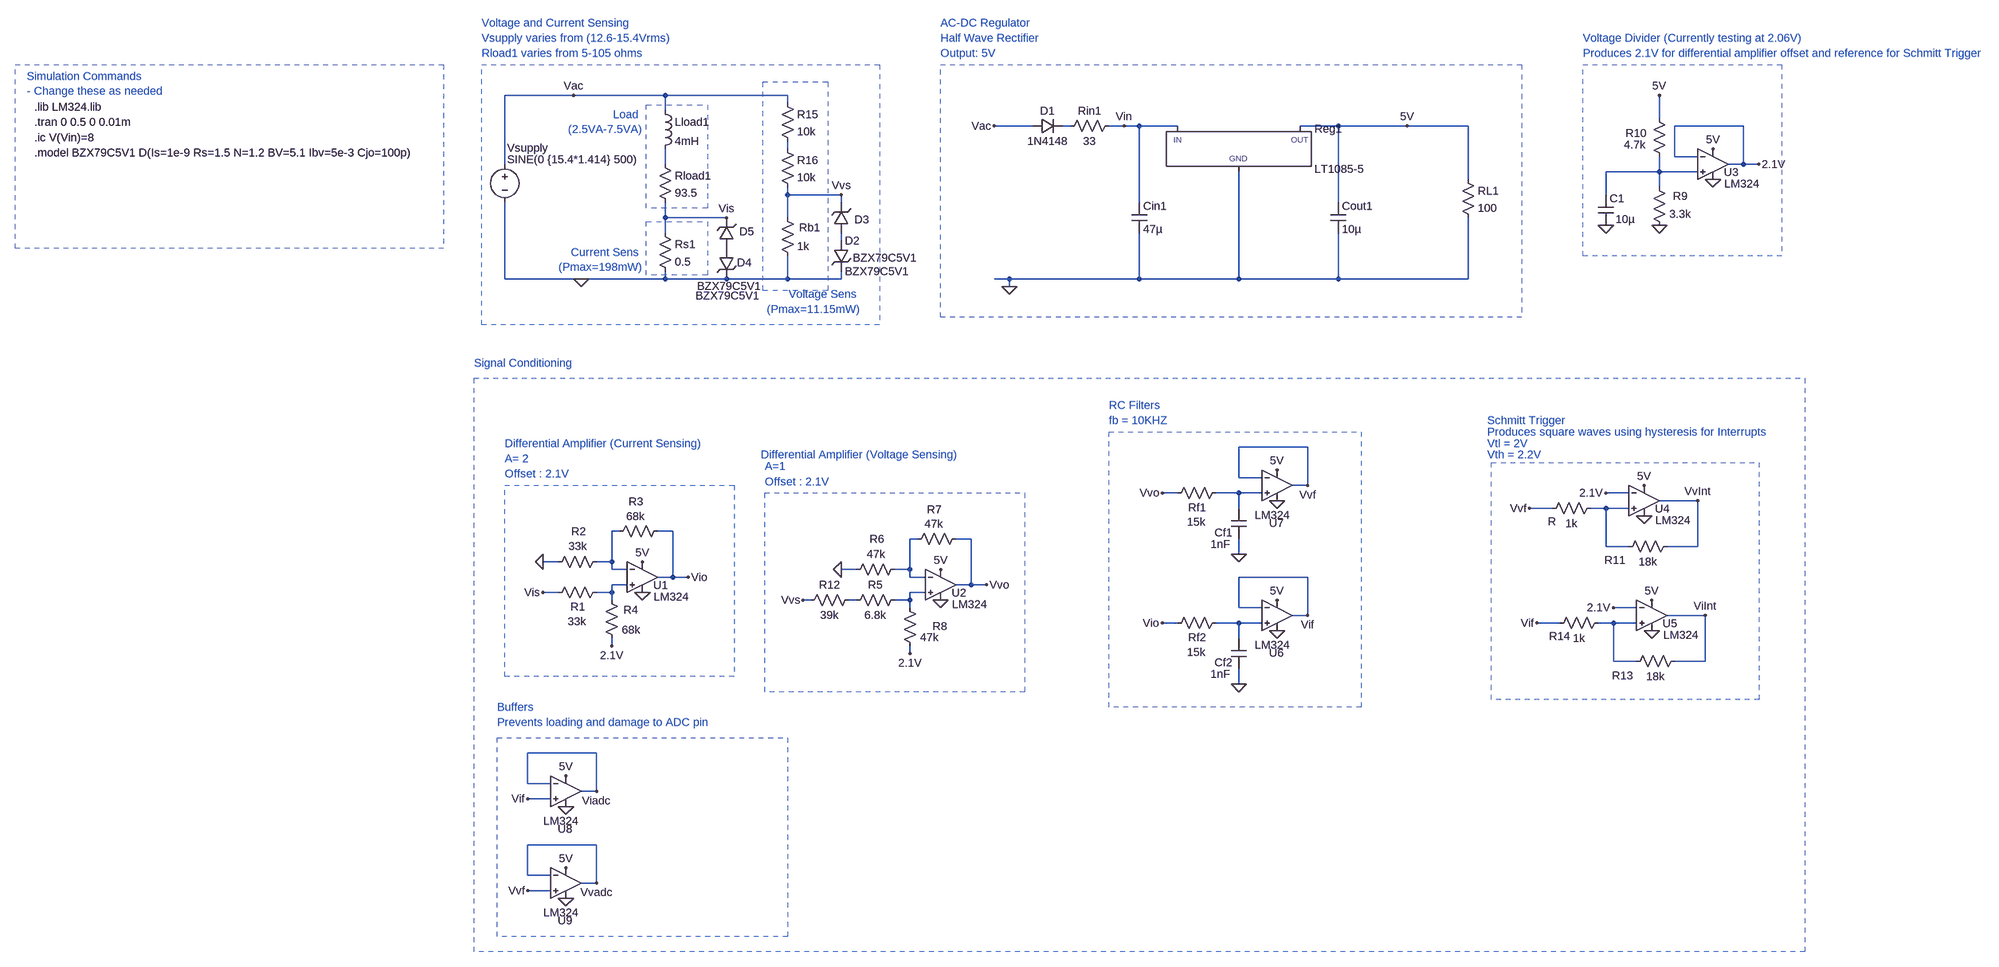
[diagram p0: schematic LTspice Model.asc]
LTspice Model.asc, the LTspice schematic file:
Version 4.1
SHEET 1 2932 1380
WIRE -528 -960 -672 -960
WIRE -336 -960 -528 -960
WIRE -80 -960 -336 -960
WIRE -80 -944 -80 -960
WIRE -336 -928 -336 -960
WIRE 1744 -912 1744 -960
WIRE 432 -896 352 -896
WIRE 512 -896 496 -896
WIRE 624 -896 592 -896
WIRE 656 -896 624 -896
WIRE 736 -896 656 -896
WIRE 1072 -896 992 -896
WIRE 1216 -896 1072 -896
WIRE 1344 -896 1216 -896
WIRE 1920 -896 1776 -896
WIRE -80 -848 -80 -864
WIRE 1776 -832 1776 -896
WIRE 1824 -832 1776 -832
WIRE -672 -816 -672 -960
WIRE -336 -816 -336 -848
WIRE 1920 -816 1920 -896
WIRE 1920 -816 1888 -816
WIRE 1952 -816 1920 -816
WIRE 1744 -800 1744 -832
WIRE 1744 -800 1632 -800
WIRE 1824 -800 1744 -800
WIRE 1344 -784 1344 -896
WIRE 1744 -768 1744 -800
WIRE -80 -752 -80 -768
WIRE 32 -752 -80 -752
WIRE 1632 -752 1632 -800
WIRE 32 -736 32 -752
WIRE 656 -736 656 -896
WIRE 1072 -736 1072 -896
WIRE -336 -704 -336 -736
WIRE -208 -704 -336 -704
WIRE -80 -704 -80 -752
WIRE -336 -672 -336 -704
WIRE 32 -656 32 -672
WIRE -672 -576 -672 -736
WIRE -512 -576 -672 -576
WIRE -336 -576 -336 -592
WIRE -336 -576 -512 -576
WIRE -208 -576 -336 -576
WIRE -80 -576 -80 -624
WIRE -80 -576 -208 -576
WIRE 32 -576 32 -592
WIRE 32 -576 -80 -576
WIRE 384 -576 352 -576
WIRE 656 -576 656 -672
WIRE 656 -576 384 -576
WIRE 864 -576 864 -800
WIRE 864 -576 656 -576
WIRE 1072 -576 1072 -672
WIRE 1072 -576 864 -576
WIRE 1344 -576 1344 -704
WIRE 1344 -576 1072 -576
WIRE 384 -560 384 -576
WIRE 1008 -224 864 -224
WIRE 864 -160 864 -224
WIRE 912 -160 864 -160
WIRE 1008 -144 1008 -224
WIRE 1008 -144 976 -144
WIRE 736 -128 704 -128
WIRE 864 -128 816 -128
WIRE 912 -128 864 -128
WIRE 1680 -128 1632 -128
WIRE 1824 -112 1744 -112
WIRE 864 -96 864 -128
WIRE 1520 -96 1472 -96
WIRE 1632 -96 1600 -96
WIRE 1680 -96 1632 -96
WIRE -432 -48 -448 -48
WIRE -320 -48 -352 -48
WIRE 192 -32 176 -32
WIRE 304 -32 272 -32
WIRE 1632 -16 1632 -96
WIRE 1680 -16 1632 -16
WIRE 1824 -16 1824 -112
WIRE 1824 -16 1760 -16
WIRE 864 0 864 -32
WIRE -560 16 -592 16
WIRE -448 16 -448 -48
WIRE -448 16 -480 16
WIRE -448 32 -448 16
WIRE -416 32 -448 32
WIRE 64 32 32 32
WIRE 176 32 176 -32
WIRE 176 32 144 32
WIRE -320 48 -320 -48
WIRE -320 48 -352 48
WIRE -288 48 -320 48
WIRE 176 48 176 32
WIRE 208 48 176 48
WIRE 1008 48 864 48
WIRE -416 64 -448 64
WIRE 304 64 304 -32
WIRE 304 64 272 64
WIRE 336 64 304 64
WIRE -560 80 -592 80
WIRE -448 80 -448 64
WIRE -448 80 -480 80
WIRE 208 80 176 80
WIRE -448 96 -448 80
WIRE -32 96 -48 96
WIRE 64 96 48 96
WIRE 176 96 176 80
WIRE 176 96 144 96
WIRE 176 112 176 96
WIRE 864 112 864 48
WIRE 912 112 864 112
WIRE 1696 112 1648 112
WIRE 1008 128 1008 48
WIRE 1008 128 976 128
WIRE 1840 128 1760 128
WIRE 736 144 704 144
WIRE 864 144 816 144
WIRE 912 144 864 144
WIRE 1536 144 1488 144
WIRE 1648 144 1616 144
WIRE 1696 144 1648 144
WIRE 864 176 864 144
WIRE -448 192 -448 176
WIRE 176 208 176 192
WIRE 1648 224 1648 144
WIRE 1696 224 1648 224
WIRE 1840 224 1840 128
WIRE 1840 224 1776 224
WIRE 864 272 864 240
WIRE -480 416 -624 416
WIRE -624 480 -624 416
WIRE -576 480 -624 480
WIRE -480 496 -480 416
WIRE -480 496 -512 496
WIRE -576 512 -624 512
WIRE -480 608 -624 608
WIRE -624 672 -624 608
WIRE -576 672 -624 672
WIRE -480 688 -480 608
WIRE -480 688 -512 688
WIRE -576 704 -624 704
FLAG -512 -576 0
FLAG -528 -960 Vac
FLAG -208 -704 Vis
FLAG 32 -752 Vvs
FLAG -384 80 0
FLAG -384 16 5V
FLAG -592 80 Vis
FLAG -592 16 0
FLAG -288 48 Vio
FLAG -448 192 2.1V
FLAG 240 96 0
FLAG 240 32 5V
FLAG 32 32 0
FLAG 336 64 Vvo
FLAG 176 208 2.1V
FLAG 384 -560 0
FLAG 352 -896 Vac
FLAG 1216 -896 5V
FLAG 624 -896 Vin
FLAG 864 0 0
FLAG 704 -128 Vvo
FLAG 864 272 0
FLAG 704 144 Vio
FLAG 1856 -784 0
FLAG 1856 -848 5V
FLAG 1952 -816 2.1V
FLAG 1744 -688 0
FLAG 1712 -80 0
FLAG 1712 -144 5V
FLAG 1728 160 0
FLAG 1728 96 5V
FLAG 1840 128 ViInt
FLAG 1824 -112 VvInt
FLAG 1744 -960 5V
FLAG 1632 -688 0
FLAG 1472 -96 Vvf
FLAG 1488 144 Vif
FLAG 1648 112 2.1V
FLAG 944 160 0
FLAG 944 96 5V
FLAG 1008 128 Vif
FLAG 944 -112 0
FLAG 944 -176 5V
FLAG 1008 -144 Vvf
FLAG 1632 -128 2.1V
FLAG -544 528 0
FLAG -544 464 5V
FLAG -480 496 Viadc
FLAG -624 512 Vif
FLAG -544 720 0
FLAG -544 656 5V
FLAG -480 688 Vvadc
FLAG -624 704 Vvf
FLAG -48 96 Vvs
SYMBOL voltage -672 -832 R0
WINDOW 0 5 -18 Left 2
WINDOW 3 5 6 Left 2
WINDOW 123 0 0 Left 0
WINDOW 39 0 0 Left 0
SYMATTR InstName Vsupply
SYMATTR Value SINE(0 {15.4*1.414} 500)
SYMBOL res -352 -832 R0
SYMATTR InstName Rload1
SYMATTR Value 93.5
SYMBOL ind -352 -944 R0
SYMATTR InstName Lload1
SYMATTR Value 4mH
SYMBOL res -352 -688 R0
SYMATTR InstName Rs1
SYMATTR Value 0.5
SYMBOL res -96 -720 R0
WINDOW 0 40 37 Left 2
SYMATTR InstName Rb1
SYMATTR Value 1k
SYMBOL Opamps/opamp2 -384 -16 R0
WINDOW 0 23 81 Left 2
WINDOW 3 24 105 Left 2
SYMATTR InstName U1
SYMATTR Value LM324
SYMBOL res -464 64 R90
WINDOW 0 62 55 VBottom 2
WINDOW 3 61 57 VTop 2
SYMATTR InstName R1
SYMATTR Value 33k
SYMBOL res -464 0 R90
WINDOW 0 -32 53 VBottom 2
WINDOW 3 -32 55 VTop 2
SYMATTR InstName R2
SYMATTR Value 33k
SYMBOL res -336 -64 R90
WINDOW 0 -30 61 VBottom 2
WINDOW 3 -31 62 VTop 2
SYMATTR InstName R3
SYMATTR Value 68k
SYMBOL res -432 192 R180
WINDOW 0 -39 75 Left 2
WINDOW 3 -44 34 Left 2
SYMATTR InstName R4
SYMATTR Value 68k
SYMBOL Opamps/opamp2 240 0 R0
WINDOW 0 23 81 Left 2
WINDOW 3 24 105 Left 2
SYMATTR InstName U2
SYMATTR Value LM324
SYMBOL res 160 16 R90
WINDOW 0 -32 53 VBottom 2
WINDOW 3 -32 55 VTop 2
SYMATTR InstName R6
SYMATTR Value 47k
SYMBOL res 288 -48 R90
WINDOW 0 -30 61 VBottom 2
WINDOW 3 -31 62 VTop 2
SYMATTR InstName R7
SYMATTR Value 47k
SYMBOL res 192 208 R180
WINDOW 0 -62 57 Left 2
WINDOW 3 -44 34 Left 2
SYMATTR InstName R8
SYMATTR Value 47k
SYMBOL PowerProducts/LT1085-5 864 -896 R0
SYMATTR InstName Reg1
SYMBOL res 1328 -800 R0
SYMATTR InstName RL1
SYMATTR Value 100
SYMBOL res 608 -912 R90
WINDOW 0 0 56 VBottom 2
WINDOW 3 32 56 VTop 2
SYMATTR InstName Rin1
SYMATTR Value 33
SYMBOL diode 432 -880 R270
WINDOW 0 32 32 VTop 2
WINDOW 3 0 32 VBottom 2
SYMATTR InstName D1
SYMATTR Value 1N4148
SYMBOL cap 640 -736 R0
SYMATTR InstName Cin1
SYMATTR Value 47µ
SYMATTR SpiceLine Rser=0.001
SYMBOL cap 1056 -736 R0
SYMATTR InstName Cout1
SYMATTR Value 10µ
SYMATTR SpiceLine Rser=0.001
SYMBOL res 832 -144 R90
WINDOW 0 62 55 VBottom 2
WINDOW 3 61 57 VTop 2
SYMATTR InstName Rf1
SYMATTR Value 15k
SYMBOL cap 880 -32 R180
WINDOW 0 29 13 Left 2
WINDOW 3 33 -11 Left 2
SYMATTR InstName Cf1
SYMATTR Value 1nF
SYMBOL res 832 128 R90
WINDOW 0 62 55 VBottom 2
WINDOW 3 61 57 VTop 2
SYMATTR InstName Rf2
SYMATTR Value 15k
SYMBOL cap 880 240 R180
WINDOW 0 29 13 Left 2
WINDOW 3 33 -11 Left 2
SYMATTR InstName Cf2
SYMATTR Value 1nF
SYMBOL Opamps/opamp2 1856 -880 R0
WINDOW 0 23 81 Left 2
WINDOW 3 24 105 Left 2
SYMATTR InstName U3
SYMATTR Value LM324
SYMBOL res 1728 -784 R0
WINDOW 0 44 35 Left 2
WINDOW 3 37 72 Left 2
SYMATTR InstName R9
SYMATTR Value 3.3k
SYMBOL res 1728 -928 R0
WINDOW 0 -55 47 Left 2
WINDOW 3 -58 71 Left 2
SYMATTR InstName R10
SYMATTR Value 4.7k
SYMBOL Opamps/opamp2 1712 -176 R0
WINDOW 0 23 81 Left 2
WINDOW 3 24 105 Left 2
SYMATTR InstName U4
SYMATTR Value LM324
SYMBOL res 1776 -32 R90
WINDOW 0 60 125 VBottom 2
WINDOW 3 32 56 VTop 2
SYMATTR InstName R11
SYMATTR Value 18k
SYMBOL res 1616 -112 R90
WINDOW 0 59 97 VBottom 2
WINDOW 3 32 56 VTop 2
SYMATTR InstName R
SYMATTR Value 1k
SYMBOL Opamps/opamp2 1728 64 R0
WINDOW 0 23 81 Left 2
WINDOW 3 24 105 Left 2
SYMATTR InstName U5
SYMATTR Value LM324
SYMBOL res 1792 208 R90
WINDOW 0 62 125 VBottom 2
WINDOW 3 32 56 VTop 2
SYMATTR InstName R13
SYMATTR Value 18k
SYMBOL res 1632 128 R90
WINDOW 0 59 97 VBottom 2
WINDOW 3 32 56 VTop 2
SYMATTR InstName R14
SYMATTR Value 1k
SYMBOL cap 1616 -752 R0
WINDOW 3 36 51 Left 2
SYMATTR Value 10µ
SYMATTR InstName C1
SYMBOL Opamps/opamp2 944 64 R0
WINDOW 0 -17 143 Left 2
WINDOW 3 -47 126 Left 2
SYMATTR InstName U6
SYMATTR Value LM324
SYMBOL Opamps/opamp2 944 -208 R0
WINDOW 0 -17 143 Left 2
WINDOW 3 -47 126 Left 2
SYMATTR InstName U7
SYMATTR Value LM324
SYMBOL Opamps/opamp2 -544 432 R0
WINDOW 0 -17 143 Left 2
WINDOW 3 -47 126 Left 2
SYMATTR InstName U8
SYMATTR Value LM324
SYMBOL Opamps/opamp2 -544 624 R0
WINDOW 0 -17 143 Left 2
WINDOW 3 -47 126 Left 2
SYMATTR InstName U9
SYMATTR Value LM324
SYMBOL zener 16 -656 R0
SYMATTR InstName D2
SYMATTR Value BZX79C5V1
SYMBOL zener 48 -672 R180
WINDOW 0 -43 28 Left 2
WINDOW 3 -142 -52 Left 2
SYMATTR InstName D3
SYMATTR Value BZX79C5V1
SYMBOL zener -224 -640 R0
WINDOW 3 -45 79 Left 2
WINDOW 0 38 30 Left 2
SYMATTR Value BZX79C5V1
SYMATTR InstName D4
SYMBOL zener -192 -640 R180
WINDOW 0 -42 35 Left 2
WINDOW 3 -53 -99 Left 2
SYMATTR InstName D5
SYMATTR Value BZX79C5V1
SYMBOL res 160 80 R90
WINDOW 0 0 56 VBottom 2
WINDOW 3 32 56 VTop 2
SYMATTR InstName R5
SYMATTR Value 6.8k
SYMBOL res 64 80 R90
WINDOW 0 0 56 VBottom 2
WINDOW 3 32 56 VTop 2
SYMATTR InstName R12
SYMATTR Value 39k
SYMBOL res -96 -960 R0
SYMATTR InstName R15
SYMATTR Value 10k
SYMBOL res -96 -864 R0
SYMATTR InstName R16
SYMATTR Value 10k
TEXT -384 -920 Right 2 ;Load \n(2.5VA-7.5VA)
TEXT -384 -632 Right 2 ;Current Sens \n(Pmax=198mW)
TEXT -672 -232 Left 2 ;Differential Amplifier (Current Sensing)
TEXT -672 -200 Left 2 ;A= 2
TEXT -672 -168 Left 2 ;Offset : 2.1V
TEXT -128 -184 Left 2 ;A=1
TEXT -128 -152 Left 2 ;Offset : 2.1V
TEXT -136 -208 Left 2 ;Differential Amplifier (Voltage Sensing)
TEXT 240 -1112 Left 2 ;AC-DC Regulator
TEXT 240 -1080 Left 2 ;Half Wave Rectifier
TEXT 72 -544 Right 2 ;Voltage Sens \n(Pmax=11.15mW)
TEXT 592 -312 Left 2 ;RC Filters
TEXT 592 -280 Left 2 ;fb = 10KHZ
TEXT -720 -1112 Left 2 ;Voltage and Current Sensing
TEXT -1656 -936 Left 2 !.lib LM324.lib
TEXT -1672 -1000 Left 2 ;Simulation Commands\n- Change these as needed
TEXT -1656 -904 Left 2 !.tran 0 0.5 0 0.01m
TEXT 1584 -1080 Left 2 ;Voltage Divider (Currently testing at 2.06V)
TEXT 1584 -1048 Left 2 ;Produces 2.1V for differential amplifier offset and reference for Schmitt Trigger
TEXT 240 -1048 Left 2 ;Output: 5V
TEXT 1384 -280 Left 2 ;Schmitt Trigger
TEXT 1384 -256 Left 2 ;Produces square waves using hysteresis for Interrupts
TEXT -720 -1080 Left 2 ;Vsupply varies from (12.6-15.4Vrms)
TEXT 1384 -232 Left 2 ;Vtl = 2V
TEXT 1384 -208 Left 2 ;Vth = 2.2V
TEXT -1656 -872 Left 2 !.ic V(Vin)=8
TEXT -1656 -840 Left 2 !.model BZX79C5V1 D(Is=1e-9 Rs=1.5 N=1.2 BV=5.1 Ibv=5e-3 Cjo=100p)
TEXT -688 320 Left 2 ;Buffers
TEXT -688 352 Left 2 ;Prevents loading and damage to ADC pin
TEXT -736 -400 Left 2 ;Signal Conditioning
TEXT -720 -1048 Left 2 ;Rload1 varies from 5-105 ohms
RECTANGLE Normal -376 -940 -248 -724 2
RECTANGLE Normal -376 -696 -248 -584 2
RECTANGLE Normal -132 -988 4 -552 2
RECTANGLE Normal -192 256 -672 -144 2
RECTANGLE Normal 1456 -496 240 -1024 2
RECTANGLE Normal 1120 320 592 -256 2
RECTANGLE Normal 112 -480 -720 -1024 2
RECTANGLE Normal 2000 -624 1584 -1024 2
RECTANGLE Normal 1952 304 1392 -192 2
RECTANGLE Normal -800 -640 -1696 -1024 2
RECTANGLE Normal -80 800 -688 384 2
RECTANGLE Normal 2048 832 -736 -368 2
RECTANGLE Normal 416 288 -128 -128 2

The netlist it stands for:
* LTspice Model.asc
Vsupply Vac 0 SINE(0 {15.4*1.414} 500)
Rload1 N003 Vis 93.5
Lload1 Vac N003 4mH
Rs1 Vis 0 0.5
Rb1 Vvs 0 1k
X§U1 N010 N008 5V 0 Vio LM324  ; pins In+ In- V+ V- OUT
R1 N010 Vis 33k
R2 N008 0 33k
R3 Vio N008 68k
R4 2.1V N010 68k
X§U2 N011 N009 5V 0 Vvo LM324  ; pins In+ In- V+ V- OUT
R6 N009 0 47k
R7 Vvo N009 47k
R8 2.1V N011 47k
X§Reg1 0 5V Vin LT1085-5  ; pins GND OUT IN
RL1 5V 0 100
Rin1 Vin N001 33
D1 Vac N001 1N4148
Cin1 Vin 0 47µ Rser=0.001
Cout1 5V 0 10µ Rser=0.001
Rf1 N006 Vvo 15k
Cf1 0 N006 1nF
Rf2 N013 Vio 15k
Cf2 0 N013 1nF
X§U3 N004 2.1V 5V 0 2.1V LM324  ; pins In+ In- V+ V- OUT
R9 N004 0 3.3k
R10 5V N004 4.7k
X§U4 N007 2.1V 5V 0 VvInt LM324  ; pins In+ In- V+ V- OUT
R11 VvInt N007 18k
R N007 Vvf 1k
X§U5 N014 2.1V 5V 0 ViInt LM324  ; pins In+ In- V+ V- OUT
R13 ViInt N014 18k
R14 N014 Vif 1k
C1 N004 0 10µ
X§U6 N013 Vif 5V 0 Vif LM324  ; pins In+ In- V+ V- OUT
X§U7 N006 Vvf 5V 0 Vvf LM324  ; pins In+ In- V+ V- OUT
X§U8 Vif Viadc 5V 0 Viadc LM324  ; pins In+ In- V+ V- OUT
X§U9 Vvf Vvadc 5V 0 Vvadc LM324  ; pins In+ In- V+ V- OUT
D2 N005 0 BZX79C5V1
D3 N005 Vvs BZX79C5V1
D4 P001 0 BZX79C5V1
D5 P001 Vis BZX79C5V1
R5 N011 N012 6.8k
R12 N012 Vvs 39k
R15 Vac N002 10k
R16 N002 Vvs 10k
.model D D
.lib standard.dio
* Load
* (2.5VA-7.5VA)
* Current Sens
* (Pmax=198mW)
* Differential Amplifier (Current Sensing)
* A= 2
* Offset : 2.1V
* A=1
* Offset : 2.1V
* Differential Amplifier (Voltage Sensing)
* AC-DC Regulator
* Half Wave Rectifier
* Voltage Sens
* (Pmax=11.15mW)
* RC Filters
* fb = 10KHZ
* Voltage and Current Sensing
.lib LM324.lib
* Simulation Commands
* - Change these as needed
.tran 0 0.5 0 0.01m
* Voltage Divider (Currently testing at 2.06V)
* Produces 2.1V for differential amplifier offset and reference for Schmitt Trigger
* Output: 5V
* Schmitt Trigger
* Produces square waves using hysteresis for Interrupts
* Vsupply varies from (12.6-15.4Vrms)
* Vtl = 2V
* Vth = 2.2V
.ic V(Vin)=8
.model BZX79C5V1 D(Is=1e-9 Rs=1.5 N=1.2 BV=5.1 Ibv=5e-3 Cjo=100p)
* Buffers
* Prevents loading and damage to ADC pin
* Signal Conditioning
* Rload1 varies from 5-105 ohms
.backanno
.end